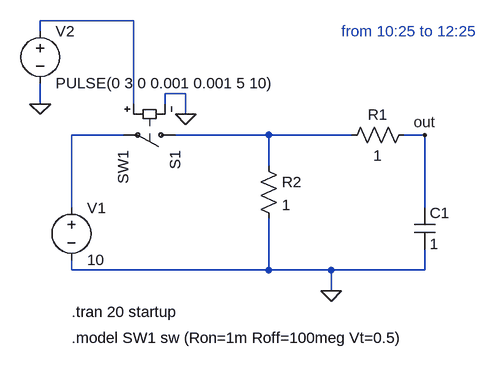
[diagram p0: schematic part3.asc]
part3.asc, the LTspice schematic file:
Version 4
SHEET 1 880 680
WIRE 112 16 -32 16
WIRE -32 32 -32 16
WIRE 192 128 160 128
WIRE -32 144 -32 112
WIRE 112 144 112 16
WIRE 160 144 160 128
WIRE 192 160 192 128
WIRE 96 192 16 192
WIRE 320 192 176 192
WIRE 448 192 320 192
WIRE 560 192 528 192
WIRE 320 240 320 192
WIRE 16 304 16 192
WIRE 560 304 560 192
WIRE 16 400 16 384
WIRE 320 400 320 320
WIRE 320 400 16 400
WIRE 416 400 320 400
WIRE 560 400 560 368
WIRE 560 400 416 400
WIRE 416 432 416 400
FLAG 416 432 0
FLAG -32 144 0
FLAG 192 160 0
FLAG 560 192 out
SYMBOL sw 192 192 R90
SYMATTR InstName S1
SYMATTR Value SW1
SYMBOL voltage 16 288 R0
SYMATTR InstName V1
SYMATTR Value 10
SYMBOL res 544 176 R90
WINDOW 0 0 56 VBottom 2
WINDOW 3 32 56 VTop 2
SYMATTR InstName R1
SYMATTR Value 1
SYMBOL cap 544 304 R0
SYMATTR InstName C1
SYMATTR Value 1
SYMBOL voltage -32 16 R0
SYMATTR InstName V2
SYMATTR Value PULSE(0 3 0 0.001 0.001 5 10)
SYMBOL res 304 224 R0
SYMATTR InstName R2
SYMATTR Value 1
TEXT 16 464 Left 2 !.tran 20 startup
TEXT 16 504 Left 2 !.model SW1 sw (Ron=1m Roff=100meg Vt=0.5)
TEXT 432 32 Left 2 ;from 10:25 to 12:25

The netlist it stands for:
* part3.asc
S1 N003 N002 N001 0 SW1
V1 N002 0 10
R1 out N003 1
C1 out 0 1
V2 N001 0 PULSE(0 3 0 0.001 0.001 5 10)
R2 N003 0 1
.tran 20 startup
.model SW1 sw (Ron=1m Roff=100meg Vt=0.5)
* from 10:25 to 12:25
.backanno
.end